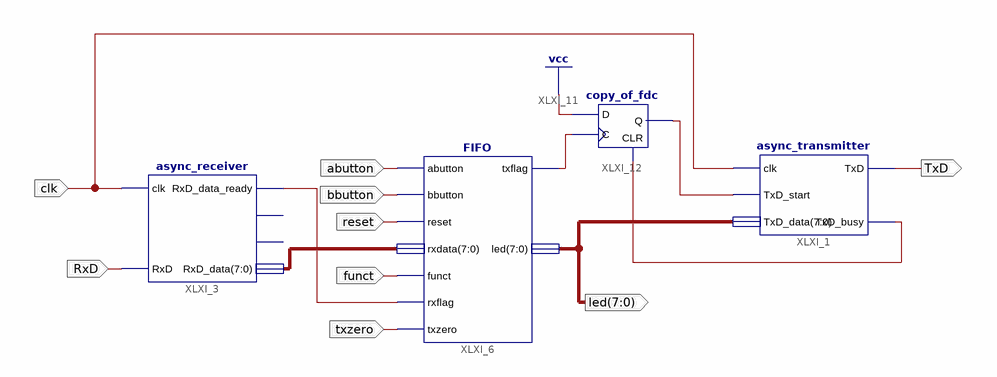
[diagram p0: schematic sheet 1]
// Xilinx ISE schematic loop22op.sch (zynq) as structural Verilog: 4 symbols, 9 ports
module loop22op (
  input  abutton,
  input  bbutton,
  input  clk,
  input  RxD,
  input  funct,
  input  reset,
  input  txzero,
  output [7:0] led,
  output TxD
);

  wire XLXN_10, XLXN_23, XLXN_32, XLXN_33;
  wire [7:0] XLXN_11;

  async_receiver XLXI_3 (
    .clk(clk), .RxD(RxD), .RxD_data_ready(XLXN_10), .RxD_data(XLXN_11));  // open: RxD_idle, RxD_endofpacket
  FIFO XLXI_6 (
    .abutton(abutton), .bbutton(bbutton), .funct(funct), .rxflag(XLXN_10), .reset(reset), .rxdata(XLXN_11),
    .txflag(XLXN_32), .led(led), .txzero(txzero));
  copy_of_fdc XLXI_12 (.CLR(XLXN_33), .C(XLXN_32), .D(1'b1), .Q(XLXN_23));
  async_transmitter XLXI_1 (.clk(clk), .TxD_start(XLXN_23), .TxD_data(led), .TxD(TxD), .TxD_busy(XLXN_33));
endmodule
